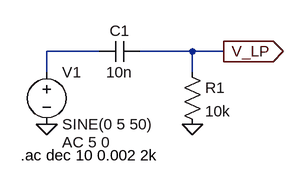
[diagram p0: schematic Low_Pass_RC_filter.asc]
Low_Pass_RC_filter.asc, the LTspice schematic file:
Version 4.1
SHEET 1 880 680
WIRE 64 32 -16 32
WIRE 208 32 128 32
WIRE 256 32 208 32
WIRE -16 64 -16 32
WIRE 208 64 208 32
FLAG -16 144 0
FLAG 208 144 0
FLAG 256 32 V_LP
IOPIN 256 32 Out
SYMBOL voltage -16 48 R0
WINDOW 123 24 124 Left 2
WINDOW 39 0 0 Left 0
SYMATTR InstName V1
SYMATTR Value SINE(0 5 50)
SYMATTR Value2 AC 5 0
SYMBOL cap 128 16 R90
WINDOW 0 0 32 VBottom 2
WINDOW 3 32 32 VTop 2
SYMATTR InstName C1
SYMATTR Value 10n
SYMBOL res 192 48 R0
SYMATTR InstName R1
SYMATTR Value 10k
TEXT -56 192 Left 2 !.ac dec 10 0.002 2k

The netlist it stands for:
* Low_Pass_RC_filter.asc
V1 N001 0 SINE(0 5 50) AC 5 0
C1 V_LP N001 10n
R1 V_LP 0 10k
.ac dec 10 0.002 2k
.backanno
.end